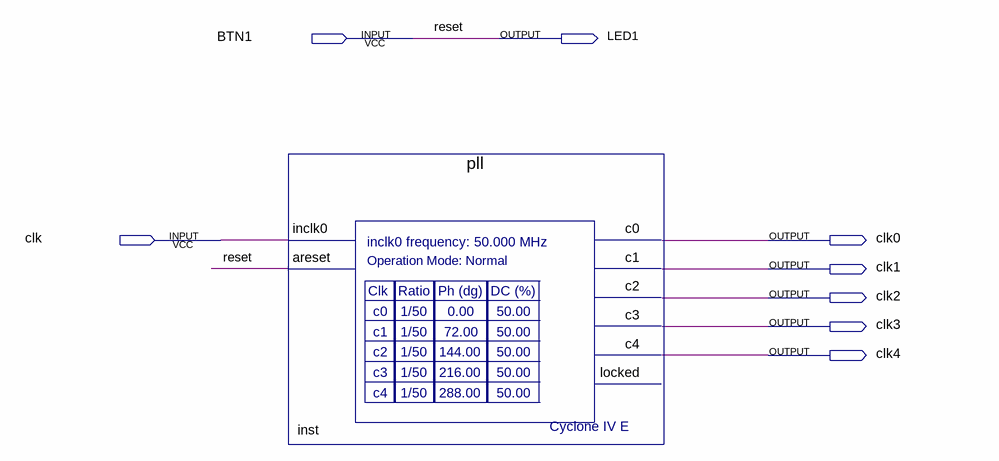
[diagram p0: schematic sheet]
// Quartus schematic DE0Nano_Test.bdf as structural Verilog: 1 symbols, 8 pins
module DE0Nano_Test (
  input  BTN1,
  input  clk,
  output LED1,
  output clk0,
  output clk1,
  output clk2,
  output clk3,
  output clk4
);

  pll inst (.inclk0(clk), .areset(BTN1), .c0(clk0), .c1(clk1), .c2(clk2), .c3(clk3), .c4(clk4));  // open: locked

  assign LED1 = BTN1;

  // Other names for the same wires on the sheet: reset = BTN1
endmodule
